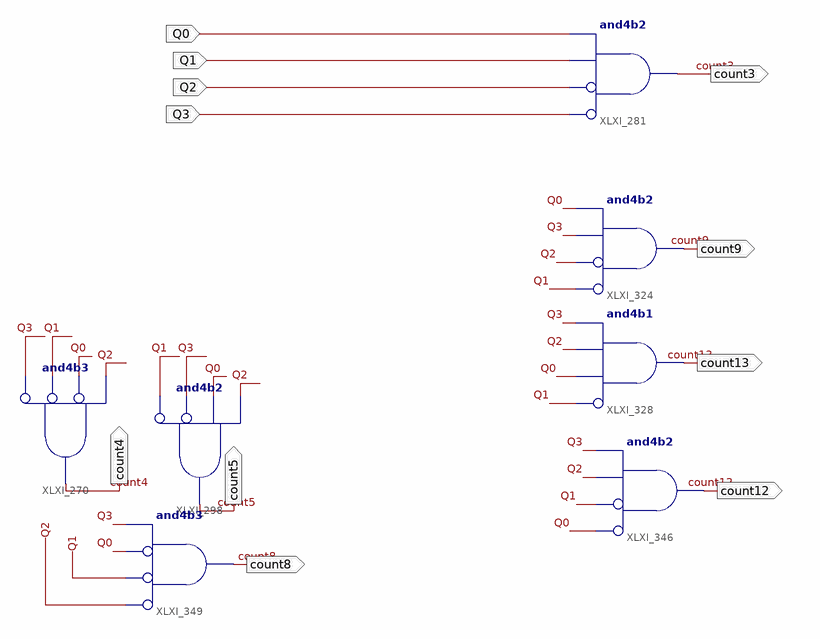
[diagram p0: schematic sheet 1]
// Xilinx ISE schematic stateCount.sch (spartan3e) as structural Verilog: 7 symbols, 11 ports
module stateCount (
  input  Q0,
  input  Q3,
  input  Q2,
  input  Q1,
  output count3,
  output count9,
  output count13,
  output count12,
  output count5,
  output count4,
  output count8
);

  and XLXI_281 (count3, ~Q3, ~Q2, Q1, Q0);  // and4b2
  and XLXI_324 (count9, ~Q1, ~Q2, Q3, Q0);  // and4b2
  and XLXI_328 (count13, ~Q1, Q0, Q2, Q3);  // and4b1
  and XLXI_346 (count12, ~Q0, ~Q1, Q2, Q3);  // and4b2
  and XLXI_298 (count5, ~Q1, ~Q3, Q0, Q2);  // and4b2
  and XLXI_270 (count4, ~Q3, ~Q1, ~Q0, Q2);  // and4b3
  and XLXI_349 (count8, ~Q2, ~Q1, ~Q0, Q3);  // and4b3
endmodule
